# EAGLE design Transmiter FM v0.1 (EAGLE 9.6.2)
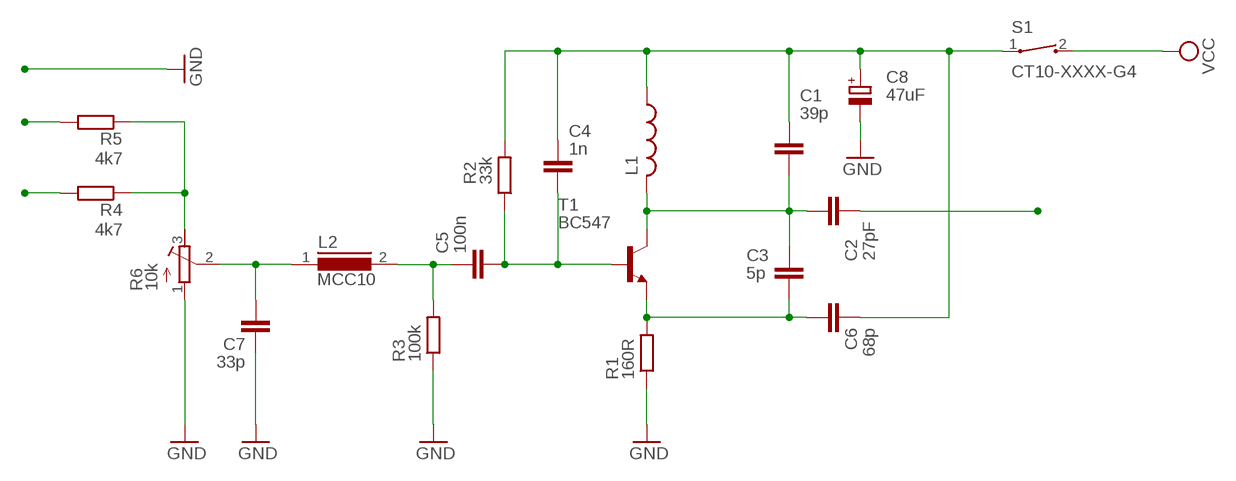
[diagram p0: schematic, sheet 1]

## Parts
C1  39p  C-EU025-024X044  [C025-024X044]
C2  27pF  C-EU025-024X044  [C025-024X044]
C3  5p  C-EU025-024X044  [C025-024X044]
C4  1n  C-EU025-024X044  [C025-024X044]
C5  100n  C-EU025-024X044  [C025-024X044]
C6  68p  C-EU025-024X044  [C025-024X044]
C7  33p  C-EU025-024X044  [C025-024X044]
C8  47uF  CPOL-EUE5-10.5  [E5-10,5]
L1  L-US0204/5  [0204/5]
L2  MCC10  [MCC10]
R1  160R  R-EU_0204/2V  [0204V]
R2  33k  R-EU_0204/2V  [0204V]
R3  100k  R-EU_0204/2V  [0204V]
R4  4k7  R-EU_0204/2V  [0204V]
R5  4k7  R-EU_0204/2V  [0204V]
R6  10k  R-TRIMM4G/J  [RTRIM4G/J]
S1  CT10-XXXX-G4  [CT10-XXXX-G4]
T1  BC547  [TO92]

## Nets
GND: C7.1 C8.- R1.1 R3.1 R6.1(A)
N$1: C1.2 C2.2 C3.1 L1.2 T1.3(C)
N$2: C7.2 L2.1 R6.2(S)
N$3: C5.1 L2.2 R3.2
N$4: C4.2 C5.2 R2.1 T1.2(B)
N$5: C2.1
N$6: C1.1 C4.1 C6.1 C8.+ L1.1 R2.2 S1.1
N$7: R4.1 R5.1 R6.3(E)
N$8: C3.2 C6.2 R1.2 T1.1(E)
N$9: R4.2
N$10: R5.2
VCC: S1.2

## Library data of the parts
C1-C7 = rcl:C-EU: CAPACITOR, European symbol; SPICEPREFIX: C
C8 = rcl:CPOL-EU: POLARIZED CAPACITOR, European symbol; SPICEPREFIX: C
L1 = rcl:L-US: INDUCTOR, American symbol; SPICEPREFIX: L
L2 = inductors:MCC10: INDUCTOR; SPICEPREFIX: L
R1-R5 = rcl:R-EU_: RESISTOR, European symbol; SPICEPREFIX: R
R6 = rcl:R-TRIMM: Trimm resistor; SPICEMODEL: X; SPICEPREFIXL: POT
S1 = switch-coto:CT10-XXXX-: CT10 Series Molded Switch Source: www.cotorelay.com .. Coto_Technology__CT10-1530-G1.pdf
T1 = transistor:BC547: NPN TRANSISTOR

## Board
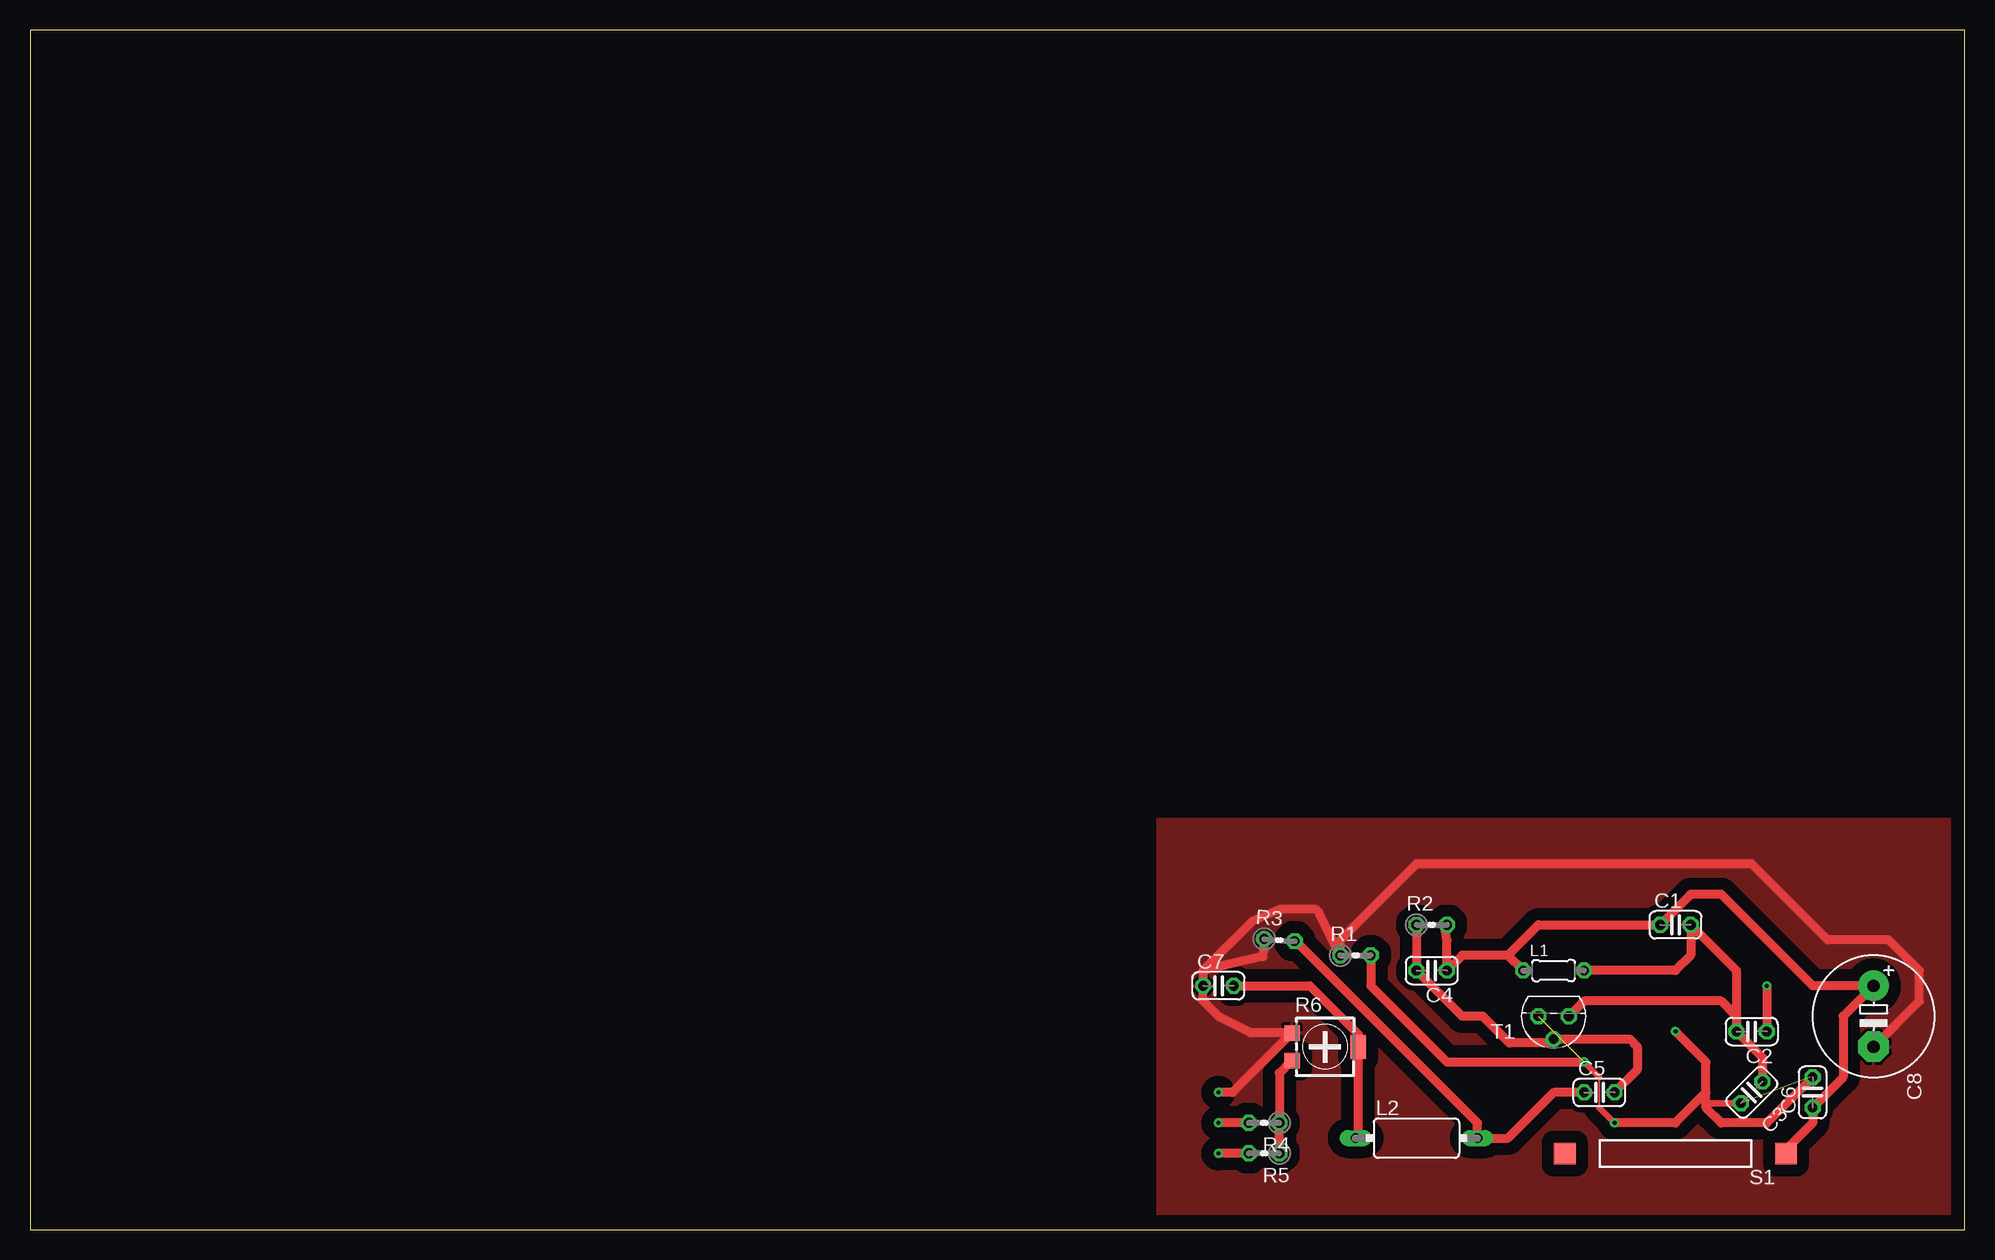
[diagram p1: board, top side]

Size 161.27 x 100 mm. Coordinates in mm from the lower left corner, seen from the top.
Outline: 0,0 161.27,0 161.27,100 0,100 0,0
Copper layers (1*16): Top 0.035mm / dielectric 1.5mm / Bottom 0.035mm
Design rules "default": minimum track width 6mil, minimum drill 0.35mm, track to track 6mil, track to pad 6mil, pad to pad 6mil, via to via 6mil, smd to smd 6mil, copper to edge 40mil, drill to drill 6mil, minimum pad ring 10mil, minimum via ring 8mil, stop-mask expansion 4mil, vias tented up to drill 0mil, thermal gap 10mil

### Footprints (pad centres in the part's own frame; a part is rotated, then mirrored left to right if it is on the bottom)
C025-024X044 = drill 0.813 octagon: 1 -1.27,0; 2 1.27,0
E5-10,5 = drill 1.016 pad 2.54: + -2.54,0 | drill 1.016 pad 2.54 octagon: - 2.54,0
0204/5 = drill 0.813 octagon: 1 -2.54,0; 2 2.54,0
MCC10 = drill 0.813 long: 1 -5.08,0; 2 5.08,0
0204V = drill 0.813 octagon: 1 -1.27,0; 2 1.27,0
RTRIM4G/J = smd 1.3 x 1.3: 1 -1.15,-2.75; 3 1.15,-2.75 | smd 2 x 1.3: 2 0,2.75
CT10-XXXX-G4 = smd 1.8 x 1.8: 1 -9.2,0; 2 9.225,0
TO92 = drill 0.813 octagon: 1 1.27,0; 2 0,1.905; 3 -1.27,0

### Placement (x,y rotation side)
C1  137.16,25.4 0 top
C2  143.51,16.51 180 top
C3  143.51,11.43 225 top
C4  116.84,21.59 180 top
C5  130.81,11.43 0 top
C6  148.59,11.43 90 top
C7  99.06,20.32 0 top
C8  153.67,17.78 270 top
L1  127,21.59 0 top
L2  115.57,7.62 0 top
R1  110.49,22.86 0 top
R2  116.84,25.4 0 top
R3  104.14,24.13 355.6 top
R4  102.87,8.89 180 top
R5  102.87,6.35 180 top
R6  107.95,15.24 270 top
S1  137.16,6.35 180 top
T1  127,17.78 179.8 top

### Tracks (layer width: path | path; a pad name or v marks a point on that pad's centre or on a via)
GND
  Top 0.152: 107.44,26.42 107.19,26.67
  Top 0.762: R3.1 102.77,22.76 97.79,21.59 | 107.44,26.42 R1.1 109.22,24.13 115.57,30.48 143.51,30.48 149.86,24.13 154.94,24.13 157.48,21.59 157.48,19.05 C8.- | 99.06,11.43 100.24,11.43 R6.1 101.76,16.39 99.1,17.74 97.79,19.05 C7.1 97.79,21.59 | 97.79,21.59 101.92,25.72 104.14,26.67 107.19,26.67
  pour Top (isolate 1.016): 93.98,34.29 160.02,34.29 160.02,1.27 93.98,1.27
N$1
  Top 0.406: 142.24,17.78 C2.2
  Top 0.762: T1.3 129.54,19.05 140.97,19.05 142.24,17.78 | C3.1 144.41,14.34 C2.2 142.24,21.59 C1.2 138.43,22.86 137.16,21.59 L1.2
N$2
  Top 0.406: L2.1 110.7,7.83 | R6.2 110.7,16.3
  Top 0.762: R6.2 110.7,7.83 | 110.7,16.3 106.68,20.32 C7.2
N$3
  Top 0.406: 105.41,24.13 R3.2
  Top 0.762: C5.1 127,11.43 123.19,7.62 L2.2 120.65,8.89 105.41,24.13
N$4
  Top 0.406: T1.2 126.99,15.55
  Top 0.762: T1.2 133.34,15.88 133.98,15.24 133.98,13.33 C5.2 | R2.1 C4.2 119.38,17.78 121.1,17.78 123.33,15.55 126.99,15.55
N$5  (via drill 0.35)
  Top 0.762: v144.78,20.32 C2.1
N$6
  Top 0.406: S1.1 146.36,6.66
  Top 0.762: R2.2 117.96,24.94 118.11,24.13 C4.1 119.38,22.86 123.19,22.86 | 146.36,6.66 148.59,8.89 C6.1 151.13,12.7 151.13,17.78 C8.+ 148.59,20.32 140.97,27.94 138.43,27.94 C1.1 125.73,25.4 123.19,22.86 | L1.1 123.19,22.86
N$7
  Top 0.762: R6.3 104.14,13.03 R4.1 R5.1
N$8  (via drill 0.35)  (2 unrouted)
  Top 0.152: 130.81,10.16 130.81,12.7
  Top 0.406: 148.34,12.7 C6.2 | v137.16,16.51 137.16,16.61
  Top 0.559: C3.2 140.07,10.53 | v129.54,13.97 130.81,12.7 | v132.08,8.89 130.81,10.16
  Top 0.762: R1.2 111.76,20.32 118.11,13.97 v129.54,13.97 | v137.16,16.51 139.7,13.97 139.7,11.43 | 139.7,11.43 139.7,10.16 140.97,8.89 144.78,8.89 C6.2 | v132.08,8.89 137.16,8.89 139.7,11.43
N$9
  Top 0.762: R4.2 99.06,8.89
N$10  (via drill 0.35)
  Top 0.762: R5.2 v99.06,6.35
N$12  (via drill 0.35)
  other vias: 99.06,11.43
N$13  (via drill 0.35)
  other vias: 99.06,8.89